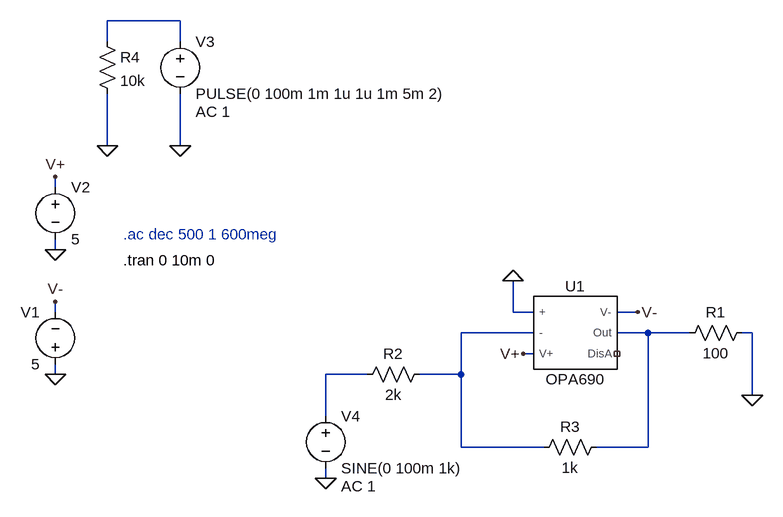
[diagram p0: schematic lab5_4.asc]
lab5_4.asc, the LTspice schematic file:
Version 4.1
SHEET 1 880 680
WIRE -384 -336 -496 -336
WIRE -496 -304 -496 -336
WIRE -384 -304 -384 -336
WIRE -496 -144 -496 -224
WIRE -384 -144 -384 -224
WIRE -576 -80 -576 -96
WIRE -576 16 -576 0
WIRE -576 112 -576 96
WIRE 128 112 128 64
WIRE 160 112 128 112
WIRE 320 112 288 112
WIRE 160 144 48 144
WIRE 336 144 288 144
WIRE 400 144 336 144
WIRE 496 144 480 144
WIRE 160 176 144 176
WIRE -576 208 -576 192
WIRE -96 208 -160 208
WIRE 48 208 48 144
WIRE 48 208 -16 208
WIRE 496 240 496 144
WIRE -160 272 -160 208
WIRE 48 320 48 208
WIRE 176 320 48 320
WIRE 336 320 336 144
WIRE 336 320 256 320
WIRE -160 368 -160 352
FLAG 496 240 0
FLAG -576 208 0
FLAG -576 16 0
FLAG -576 -96 V+
FLAG -576 96 V-
FLAG 144 176 V+
FLAG 320 112 V-
FLAG -160 368 0
FLAG 128 64 0
FLAG -384 -144 0
FLAG -496 -144 0
SYMBOL OPA690 224 144 R0
SYMATTR InstName U1
SYMBOL voltage -576 208 R180
WINDOW 0 24 96 Left 2
WINDOW 3 24 16 Left 2
WINDOW 123 0 0 Left 0
WINDOW 39 0 0 Left 0
SYMATTR InstName V1
SYMATTR Value 5
SYMBOL voltage -576 -96 R0
WINDOW 123 0 0 Left 0
WINDOW 39 0 0 Left 0
SYMATTR InstName V2
SYMATTR Value 5
SYMBOL res 496 128 R90
WINDOW 0 0 56 VBottom 2
WINDOW 3 32 56 VTop 2
SYMATTR InstName R1
SYMATTR Value 100
SYMBOL voltage -384 -320 R0
WINDOW 123 24 124 Left 2
WINDOW 39 0 0 Left 0
SYMATTR Value2 AC 1
SYMATTR InstName V3
SYMATTR Value PULSE(0 100m 1m 1u 1u 1m 5m 2)
SYMBOL voltage -160 256 R0
WINDOW 123 24 124 Left 2
WINDOW 39 0 0 Left 0
SYMATTR Value2 AC 1
SYMATTR InstName V4
SYMATTR Value SINE(0 100m 1k)
SYMBOL res 0 192 R90
WINDOW 0 0 56 VBottom 2
WINDOW 3 32 56 VTop 2
SYMATTR InstName R2
SYMATTR Value 2k
SYMBOL res 272 304 R90
WINDOW 0 0 56 VBottom 2
WINDOW 3 32 56 VTop 2
SYMATTR InstName R3
SYMATTR Value 1k
SYMBOL res -512 -320 R0
SYMATTR InstName R4
SYMATTR Value 10k
TEXT -472 -8 Left 2 ;.ac dec 500 1 600meg
TEXT -472 32 Left 2 !.tran 0 10m 0

The netlist it stands for:
* lab5_4.asc
X§U1 0 N002 V+ V- N003 NC_01 OPA690  ; pins + - V+ V- Out DisA
V1 0 V- 5
V2 V+ 0 5
R1 0 N003 100
V3 N001 0 PULSE(0 100m 1m 1u 1u 1m 5m 2) AC 1
V4 N004 0 SINE(0 100m 1k) AC 1
R2 N002 N004 2k
R3 N003 N002 1k
R4 N001 0 10k
* .ac dec 500 1 600meg
.tran 0 10m 0
.lib OPA690.LIB
.backanno
.end